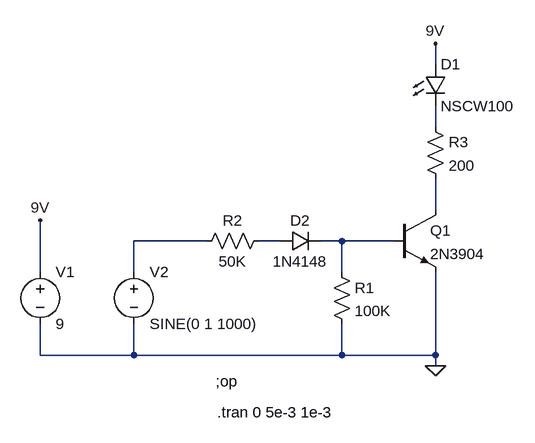
[diagram p0: schematic Draft1.asc]
Draft1.asc, the LTspice schematic file:
Version 4
SHEET 1 880 680
WIRE 192 -208 192 -240
WIRE 192 -112 192 -144
WIRE 192 16 192 -32
WIRE -160 64 -272 64
WIRE -48 64 -80 64
WIRE 48 64 16 64
WIRE 128 64 48 64
WIRE -416 112 -416 32
WIRE -272 112 -272 64
WIRE 48 112 48 64
WIRE -416 240 -416 192
WIRE -272 240 -272 192
WIRE -272 240 -416 240
WIRE 48 240 48 192
WIRE 48 240 -272 240
WIRE 192 240 192 112
WIRE 192 240 48 240
WIRE 192 256 192 240
FLAG 192 256 0
FLAG -416 32 9V
FLAG 192 -240 9V
SYMBOL npn 128 16 R0
SYMATTR InstName Q1
SYMATTR Value 2N3904
SYMBOL voltage -416 96 R0
WINDOW 123 0 0 Left 0
WINDOW 39 0 0 Left 0
SYMATTR InstName V1
SYMATTR Value 9
SYMBOL res 32 96 R0
SYMATTR InstName R1
SYMATTR Value 100K
SYMBOL res -64 48 R90
WINDOW 0 0 56 VBottom 2
WINDOW 3 32 56 VTop 2
SYMATTR InstName R2
SYMATTR Value 50K
SYMBOL res 176 -128 R0
SYMATTR InstName R3
SYMATTR Value 200
SYMBOL LED 176 -208 R0
SYMATTR InstName D1
SYMATTR Value NSCW100
SYMBOL diode -48 80 R270
WINDOW 0 32 32 VTop 2
WINDOW 3 0 32 VBottom 2
SYMATTR InstName D2
SYMATTR Value 1N4148
SYMBOL voltage -272 96 R0
WINDOW 123 0 0 Left 0
WINDOW 39 0 0 Left 0
SYMATTR InstName V2
SYMATTR Value SINE(0 1 1000)
TEXT -146 280 Left 2 !;op
TEXT -144 328 Left 2 !.tran 0 5e-3 1e-3

The netlist it stands for:
* Draft1.asc
Q1 N002 N005 0 0 2N3904
V1 9V 0 9
R1 N005 0 100K
R2 N004 N003 50K
R3 N001 N002 200
D1 9V N001 NSCW100
D2 N004 N005 1N4148
V2 N003 0 SINE(0 1 1000)
.model D D
.lib standard.dio
.model NPN NPN
.model PNP PNP
.lib standard.bjt
;op
.tran 0 5e-3 1e-3
.backanno
.end